# Altium schematic sheet 09_CAN.SchDoc: XXXXX部
size A3; ApprovedBy: 王五; CheckedBy: 李四; Engineer: 张三; Organization: Altium 17; Address1: L3, 12a Rodborough Rd; Address2: Frenchs Forest; Address3: NSW; Address4: Australia 2086; Size: A4_Landscape
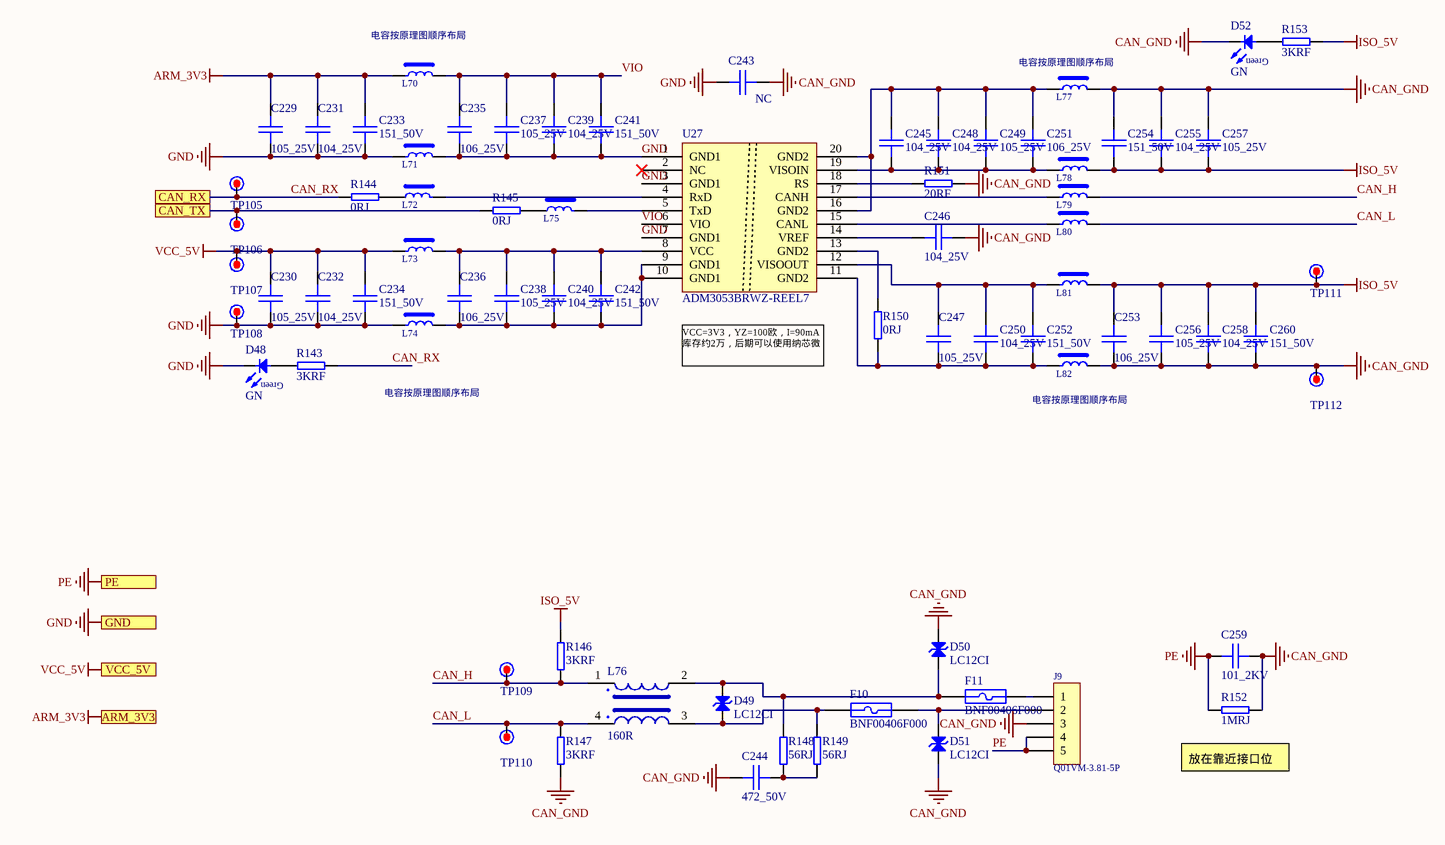
[diagram p0: 09_CAN.SchDoc]

## Parts
C229  105_25V  [0603C]
C230  105_25V  [0603C]
C231  104_25V  [0402C]
C232  104_25V  [0402C]
C233  151_50V  [0603C]
C234  151_50V  [0603C]
C235  106_25V  [0805C]
C236  106_25V  [0805C]
C237  105_25V  [0603C]
C238  105_25V  [0603C]
C239  104_25V  [0603C]
C240  104_25V  [0603C]
C241  151_50V  [0603C]
C242  151_50V  [0603C]
C243  NC  [SMDC_L11.4W6H2.5]
C244  472_50V  [0603C]
C245  104_25V  [0603C]
C246  104_25V  [0603C]
C247  105_25V  [0603C]
C248  104_25V  [0603C]
C249  105_25V  [0603C]
C250  104_25V  [0603C]
C251  106_25V  [0805C]
C252  151_50V  [0603C]
C253  106_25V  [0805C]
C254  151_50V  [0603C]
C255  104_25V  [0603C]
C256  105_25V  [0603C]
C257  105_25V  [0603C]
C258  104_25V  [0603C]
C259  101_2KV  [1812C]
C260  151_50V  [0603C]
D48  GN  [SMDD_0603G]
D49  LC12CI  [SMDD_SOD323(无极性)]
D50  LC12CI  [SMDD_SOD323(无极性)]
D51  LC12CI  [SMDD_SOD323(无极性)]
D52  GN  [SMDD_0603G]
F10  BNF00406F000  [SMDF_0603]
F11  BNF00406F000  [SMDF_0603]
J9  Q01VM-3.81-5P  [DIPJS_Q01VM_S3.81R0.8_5P]
L70  1.8K  [0402L]  (value not drawn)
L71  1.8K  [0402L]  (value not drawn)
L72  1.8K  [0402L]  (value not drawn)
L73  1.8K  [0402L]  (value not drawn)
L74  1.8K  [0402L]  (value not drawn)
L75  1.8K  [0402L]  (value not drawn)
L76  160R  [SMDL_L3.2W1.6_H1.8]
L77  1.8K  [0402L]  (value not drawn)
L78  1.8K  [0402L]  (value not drawn)
L79  1.8K  [0402L]  (value not drawn)
L80  1.8K  [0402L]  (value not drawn)
L81  1.8K  [0402L]  (value not drawn)
L82  1.8K  [0402L]  (value not drawn)
R143  3KRF  [0603R]
R144  0RJ  [0402R]
R145  0RJ  [0402R]
R146  3KRF  [0603R]
R147  3KRF  [0603R]
R148  56RJ  [0805R]
R149  56RJ  [0805R]
R150  0RJ  [0603R]
R151  20RF  [0603R]
R152  1MRJ  [2512R]
R153  3KRF  [0603R]
TP105  TP  [TP-1.0mm]  (value not drawn)  (no BOM)
TP106  TP  [TP-1.0mm]  (value not drawn)  (no BOM)
TP107  TP  [TP-1.0mm]  (value not drawn)  (no BOM)
TP108  TP  [TP-1.0mm]  (value not drawn)  (no BOM)
TP109  TP  [TP-1.0mm]  (value not drawn)  (no BOM)
TP110  TP  [TP-1.0mm]  (value not drawn)  (no BOM)
TP111  TP  [TP-1.0mm]  (value not drawn)  (no BOM)
TP112  TP  [TP-1.0mm]  (value not drawn)  (no BOM)
U27  ADM3053BRWZ-REEL7  [SMDU_SOP20-L_S1.27X10]

## Ports
ARM_3V3, CAN_RX, CAN_TX, GND, PE, VCC_5V

## Nets
ARM_3V3: C229.1 C231.1 C233.1 L70.2 ; port ARM_3V3
CAN_GND: C243.2 C244.1 C246.2 C253.2 C254.1 C255.1 C256.2 C257.1 C258.2 C259.2 C260.2 D50.2(Pin2) D51.1(Pin1) D52.2(K) J9.3 L77.1 L82.1 R147.1 R151.2 R152.2 TP112.1
GND: C229.2 C230.2 C231.2 C232.2 C233.2 C234.2 C235.2 C237.2 C239.2 C241.2 C243.1 D48.2(K) L71.1 L71.2 L74.2 TP108.1 U27.1(GND1) U27.3(GND1) U27.7(GND1) ; port GND
ISO_5V: C253.1 C254.2 C255.2 C256.1 C257.2 C258.1 C260.1 L78.1 L81.1 R146.2 R153.1 TP111.1
PE: C259.1 J9.4 J9.5 R152.1 ; port PE
VCC_5V: C230.1 C232.1 C234.1 L73.2 TP107.1 ; port VCC_5V
CAN_H: L76.1 L79.1 R146.1 TP109.1
CAN_L: L76.4 L80.1 R147.2 TP110.1
CAN_RX: R143.1 R144.2 TP105.1 ; port CAN_RX
CAN_TX: R145.2 TP106.1 ; port CAN_TX
VIO: C235.1 C237.1 C239.1 C241.1 L70.1 U27.6(VIO)
NetC236_1: C236.1 C238.1 C240.1 C242.1 L73.1 U27.8(VCC)
NetC236_2: C236.2 C238.2 C240.2 C242.2 L74.1 U27.9(GND1) U27.10(GND1)
NetC244_2: C244.2 R148.1 R149.1
NetC245_1: C245.1 C248.1 C249.1 C251.1 L77.2 U27.16(GND2) U27.20(GND2)
NetC245_2: C245.2 C248.2 C249.2 C251.2 L78.2 U27.19(VISOIN)
NetC246_1: C246.1 U27.14(VREF)
NetC247_1: C247.1 C250.1 C252.1 L81.2 U27.12(VISOOUT)
NetC247_2: C247.2 C250.2 C252.2 L82.2 R150.1 U27.11(GND2)
NetD48_1: D48.1(A) R143.2
NetD49_1: D49.1(Pin1) F10.1 L76.3 R149.2
NetD49_2: D49.2(Pin2) D50.1(Pin1) F11.1 L76.2 R148.2
NetD51_2: D51.2(Pin2) F10.2 J9.2
NetD52_1: D52.1(A) R153.2
NetF11_2: F11.2 J9.1
NetL72_1: L72.1 R144.1
NetL72_2: L72.2 U27.4(RxD)
NetL75_1: L75.1 R145.1
NetL75_2: L75.2 U27.5(TxD)
NetL79_2: L79.2 U27.17(CANH)
NetL80_2: L80.2 U27.15(CANL)
NetR150_2: R150.2 U27.13(GND2)
NetR151_1: R151.1 U27.18(RS)

Not connected (* = marked no-connect by the designer): U27 2(NC)*

## Notes on the sheet
- (near L70) 电容按原理图顺序布局
- (near L77) 电容按原理图顺序布局
- VCC=3V3，YZ=100欧，I=90mA
  库存约2万，后期可以使用纳芯微
- 电容按原理图顺序布局
- (near R152) 放在靠近接口位置
- 项 目:
- 图 名:
- 设 计:
- 审 核:
- 批 准:
- 日 期:
- 页 面:
- 软 件:
- (in symbol 1103010072) Green

## Library data of the parts
C229 C230 C237 C238 C247 C249 C256 C257 = 1102010170: 贴片电容1uF25VX7R125℃K0603; 品牌: 风华&YAGEO(国巨)&TDK&MURATA(村田); 安装方式: SMT; 检查人: 江应平; Value: 105_25V; HelpURL: \\192.168.3.3\规格书\【1102010170】贴片电容1uF25VX7R125℃K0603_风华&YAGEO(国巨)&TDK&MURATA(村田)_V001.pdf; 创建日期: 2021/2/24; 物料编码: 1102010170; 关键参数: X7R125℃K; 检查日期: 2022-01-11
C231 C232 = 1102010148: 贴片电容100nF25VX7R125℃K0402; 品牌: YAGEO(国巨)/风华/MURATA(村田)/TDK; 安装方式: SMT; 检查人: 江应平; 关键参数: X7R125℃K; 创建日期: 2019-01-04; VALUE: 104_25V; 物料编码: 1102010148; HELPURL: \\192.168.3.3\规格书\; 检查日期: 2022-01-11
C233 C234 C241 C242 C252 C254 C260 = 1102010037: 贴片电容150pF50VCOG125℃K0603; 品牌: 风华/YAGEO(国巨)/TDK/MURATA(村田); 安装方式: SMT; 检查人: 江应平; 创建日期: 2018-08-26; VALUE: 151_50V; 物料编码: 1102010037; HELPURL: \\192.168.3.3\规格书\; 关键参数: COG125℃K; 检查日期: 2022-01-11
C235 C236 C251 C253 = 1102010086: 贴片电容10uF25VX7R125℃K0805; 品牌: TDK; 安装方式: SMT; 检查人: 江应平; 关键参数: X7R125℃K; 创建日期: 2018-08-26; VALUE: 106_25V; 物料编码: 1102010086; HELPURL: \\192.168.3.3\规格书\; 检查日期: 2022-01-11
C239 C240 C245 C246 C248 C250 C255 C258 = 1102010026: 贴片电容100nF25VX7R125℃K0603; 品牌: 风华/YAGEO(国巨)/TDK/MURATA(村田); 安装方式: SMT; 检查人: 江应平; 创建日期: 2018-08-26; VALUE: 104_25V; 物料编码: 1102010026; HELPURL: \\192.168.3.3\规格书\; 关键参数: X7R125℃K; 检查日期: 2022-01-11
C243 = 电容DK1E3EA102M86RAH01: 安装方式: SMT; 品牌: 村田; 关键参数: 1000pF,250Vac; 物料编码: *; VALUE: DK1E3EA102M86RAH01; 创建日期: 2022/6/15; HELPURL: \\192.168.3.3\规格书\; 检查人: *; 检查时间: *; 可替代料: *
C244 = 1102010080: 贴片电容4.7nF50VX7R125℃K0603; 品牌: TDK; 安装方式: SMT; 检查人: 江应平; 创建日期: 2018-08-26; VALUE: 472_50V; 物料编码: 1102010080; HELPURL: \\192.168.3.3\规格书\; 关键参数: X7R125℃K; 检查日期: 2022-01-11
C259 = 1102010145: 贴片电容100pF2000VNPO125℃K1812; 品牌: 禾生堂; 安装方式: SMT; 检查人: 江应平; 创建日期: 2018-12-28; VALUE: 101_2KV; 物料编码: 1102010145; HELPURL: \\192.168.3.3\规格书\【1102010145】贴片电容100pF2000VNPO125℃K1812_信昌.pdf; 关键参数: NPO125℃K; 检查日期: 2022-01-11
D48 D52 = 1103010072: 贴片发光二极管GN0603; 关键参数: 35mA2V8V70mW绿色; 品牌: 通用; 安装方式: SMT; 检查人: 江应平; HELPURL: \\192.168.3.3\规格书\【1103010072】贴片发光二极管GNL0603_通用.pdf; 创建日期: 2019-07-10; 物料编码: 1103010072; Value: GN; 检查日期: 2022-01-17
D49-D51 = 瞬态抑制二极管(TVS)LC12CI: 品牌: Leiditech(雷卯电子); 安装方式: SMT; 关键参数: 双向 反向截止电压(Vrwm)：12V 击穿电压(最小值)：13.3V 峰值脉冲电流(Ipp)@10/1000μs：8A 最大钳位电压：30V; VALUE: LC12CI; 创建日期: 2022/9/15; HELPURL: \\192.168.3.3\规格书\
F10 F11 = 1115000150: 自恢复保险丝BNF00406F0000603; 安装方式: SMT; 品牌: Betterfuse(贝特卫士); 检查人: 江应平; HELPURL: \\192.168.3.3\规格书\【1115000150】自恢复保险丝BNF00406F0000603_Betterfuse(贝特卫士).pdf; 创建日期: 2021/6/7; 物料编码: 1115000150; VALUE: BNF00406F000; 检查日期: 2022-01-14
J9 = 1214020289: 连接座Q01VM-3.81-5P250V7A; 品牌: 慈溪正恒; 安装方式: DIP; 关键参数: 5P250V7A; 创建日期: 2018-08-26; 物料编码: 1214020289; HELPURL: \\192.168.3.3\规格书\; VALUE: Q01VM-3.81-5P
L70-L75 L77-L82 = 1111100012: 贴片磁珠1.8K200mA100MHzL0402; 品牌: MURATA(村田); 安装方式: NC; 检查人: 江应平; 物料编码: 1111100012; 创建日期: 2020-07-31; HELPURL: \\192.168.3.3\规格书\【1111100012】贴片磁珠1.8K200mA100MHzL0402_MURATA(村田).pdf; 关键参数: 200mA100MHZ; VALUE: 1.8K; 检查日期: 2022-01-14
L76 = 1111010051: 贴片共模电感160R0.34A125V1MHzSMD1206; 品牌: TRIO; 安装方式: SMT; 检查人: 江应平; HELPURL: \\192.168.3.3\规格书\【1111010051】贴片共模电感160R0.34A125V1mHz_TRIO_V001.pdf; 关键参数: 0.34A125V1MHZ; 创建日期: 2018-08-26; 物料编码: 1111010051; VALUE: 160R; 检查日期: 2022-01-14
R143 R146 R147 R153 = 1101010254: 贴片电阻3KRF0.1W100ppm0603; 品牌: YAGEO(国巨); 安装方式: SMT; 检查人: 江应平; VALUE: 3KRF; 创建日期: 2018-08-26; 物料编码: 1101010254; HELPURL: \\192.168.3.3\规格书\【1101010252】【1101010253】【1101010254】【1101010255】【1101010256】【1101010257】【1101010435】【1101010436】贴片电阻_YAGEO(国巨).pdf; 关键参数: 0.1W100ppm; 检查日期: 2022-01-06
R144 R145 = 1101010535: 贴片电阻0RJ0.0625W100ppm0402; 品牌: YAGEO(国巨); 安装方式: SMT; 检查人: 江应平; VALUE: 0RJ; 关键参数: 0.0625W100ppm; 创建日期: 2019-02-28; 物料编码: 1101010535; HELPURL: \\192.168.3.3\规格书\【1101010535】贴片电阻0RJ0.0625W100ppm0402_YAGEO(国巨).pdf; 检查日期: 2022-01-06
R148 R149 = 1101010179: 贴片电阻56RJ0.125W100ppm0805; 品牌: 风华/YAGEO(国巨)/Viking(光颉)/厚生; 安装方式: SMT; 检查人: 江应平; VALUE: 56RJ; 创建日期: 2018-08-26; 物料编码: 1101010179; HELPURL: \\192.168.3.3\规格书\; 关键参数: 0.125W100ppm; 检查日期: 2022-01-05
R150 = 1101010220: 贴片电阻0RJ0.1W0603; 品牌: 风华/YAGEO(国巨)/Viking(光颉)/厚生; 安装方式: SMT; 关键参数: 0.1W; 检查人: 江应平; VALUE: 0RJ; 创建日期: 2018-08-26; 物料编码: 1101010220; HELPURL: \\192.168.3.3\规格书\; 检查日期: 2022-01-05
R151 = 1101010274: 贴片电阻20RF0.1W100ppm0603; 品牌: YAGEO(国巨); 安装方式: SMT; 检查人: 江应平; VALUE: 20RF; 创建日期: 2018-08-26; 物料编码: 1101010274; HELPURL: \\192.168.3.3\规格书\【1101010274】【1101010275】【1101010276】【1101010277】【1101010278】贴片电阻20RF0.1W100ppm0603、51RF0.1W100ppm0603、(200RF0.1W100ppm0603、330RF0.1W100ppm0603、560RF0.1W100ppm0603_YAGEO(国巨).pdf; 关键参数: 0.1W100ppm; 检查日期: 2022-01-06
R152 = 1101010313: 贴片电阻1MRJ1W100ppm2512; 品牌: YAGEO(国巨); 安装方式: SMT; 检查人: 江应平; VALUE: 1MRJ; 创建日期: 2018-08-26; 物料编码: 1101010313; HELPURL: \\192.168.3.3\规格书\【1101010313】贴片电阻1MRJ1W100ppm2512_YAGEO(国巨).pdf; 关键参数: 1W100ppm; 检查日期: 2022-01-06
TP105-TP112 = TP: 通用测试点
U27 = 1110080014: 隔离通信芯片ADM3053BRWZ-REEL7RW-20; 品牌: ADI(亚德诺); 安装方式: SMT; 检查人: 江应平; 创建日期: 2020/8/14; 物料编码: 1110080014; HELPURL: \\192.168.3.3\规格书\【1110080014】隔离通信芯片ADM3053BRWZ-REEL7RW-20_ADI(亚德诺).pdf; VALUE: ADM3053BRWZ-REEL7; 检查日期: 2022-01-13